# EAGLE design Cymru 55 (EAGLE 9.3.0)

## Sheet 1 of 2
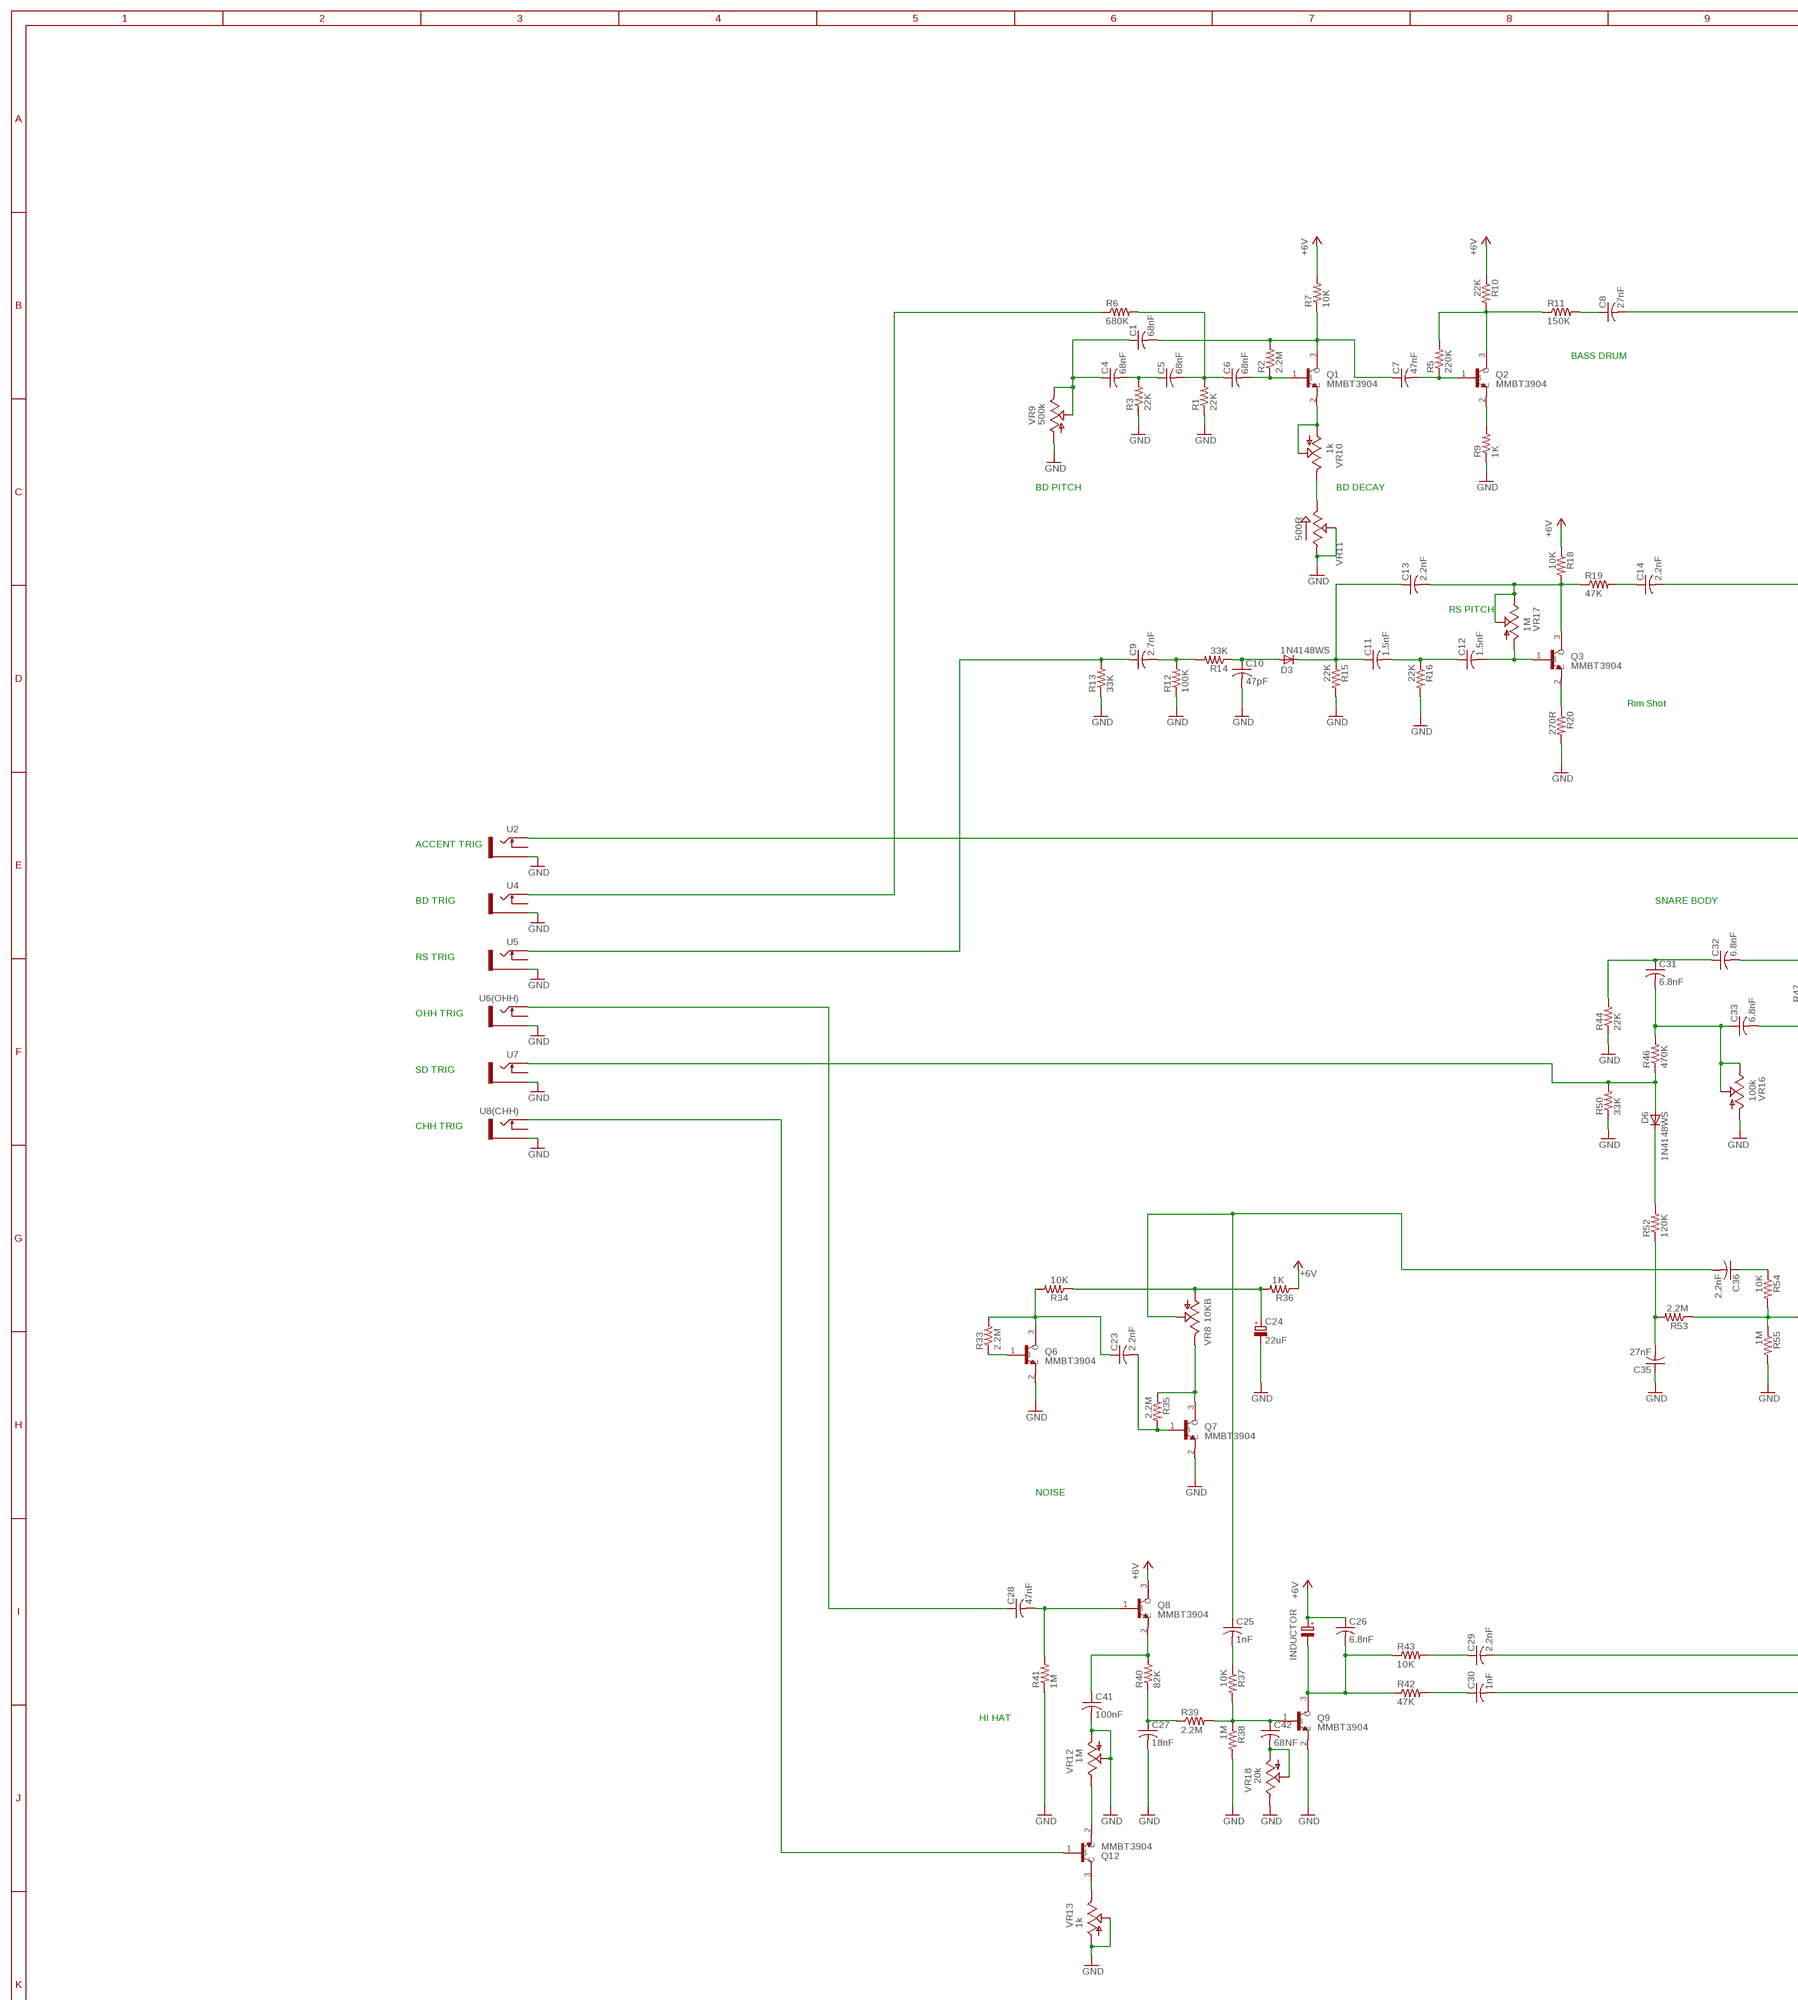
[diagram p0: schematic, sheet 1, part 1 of 3]
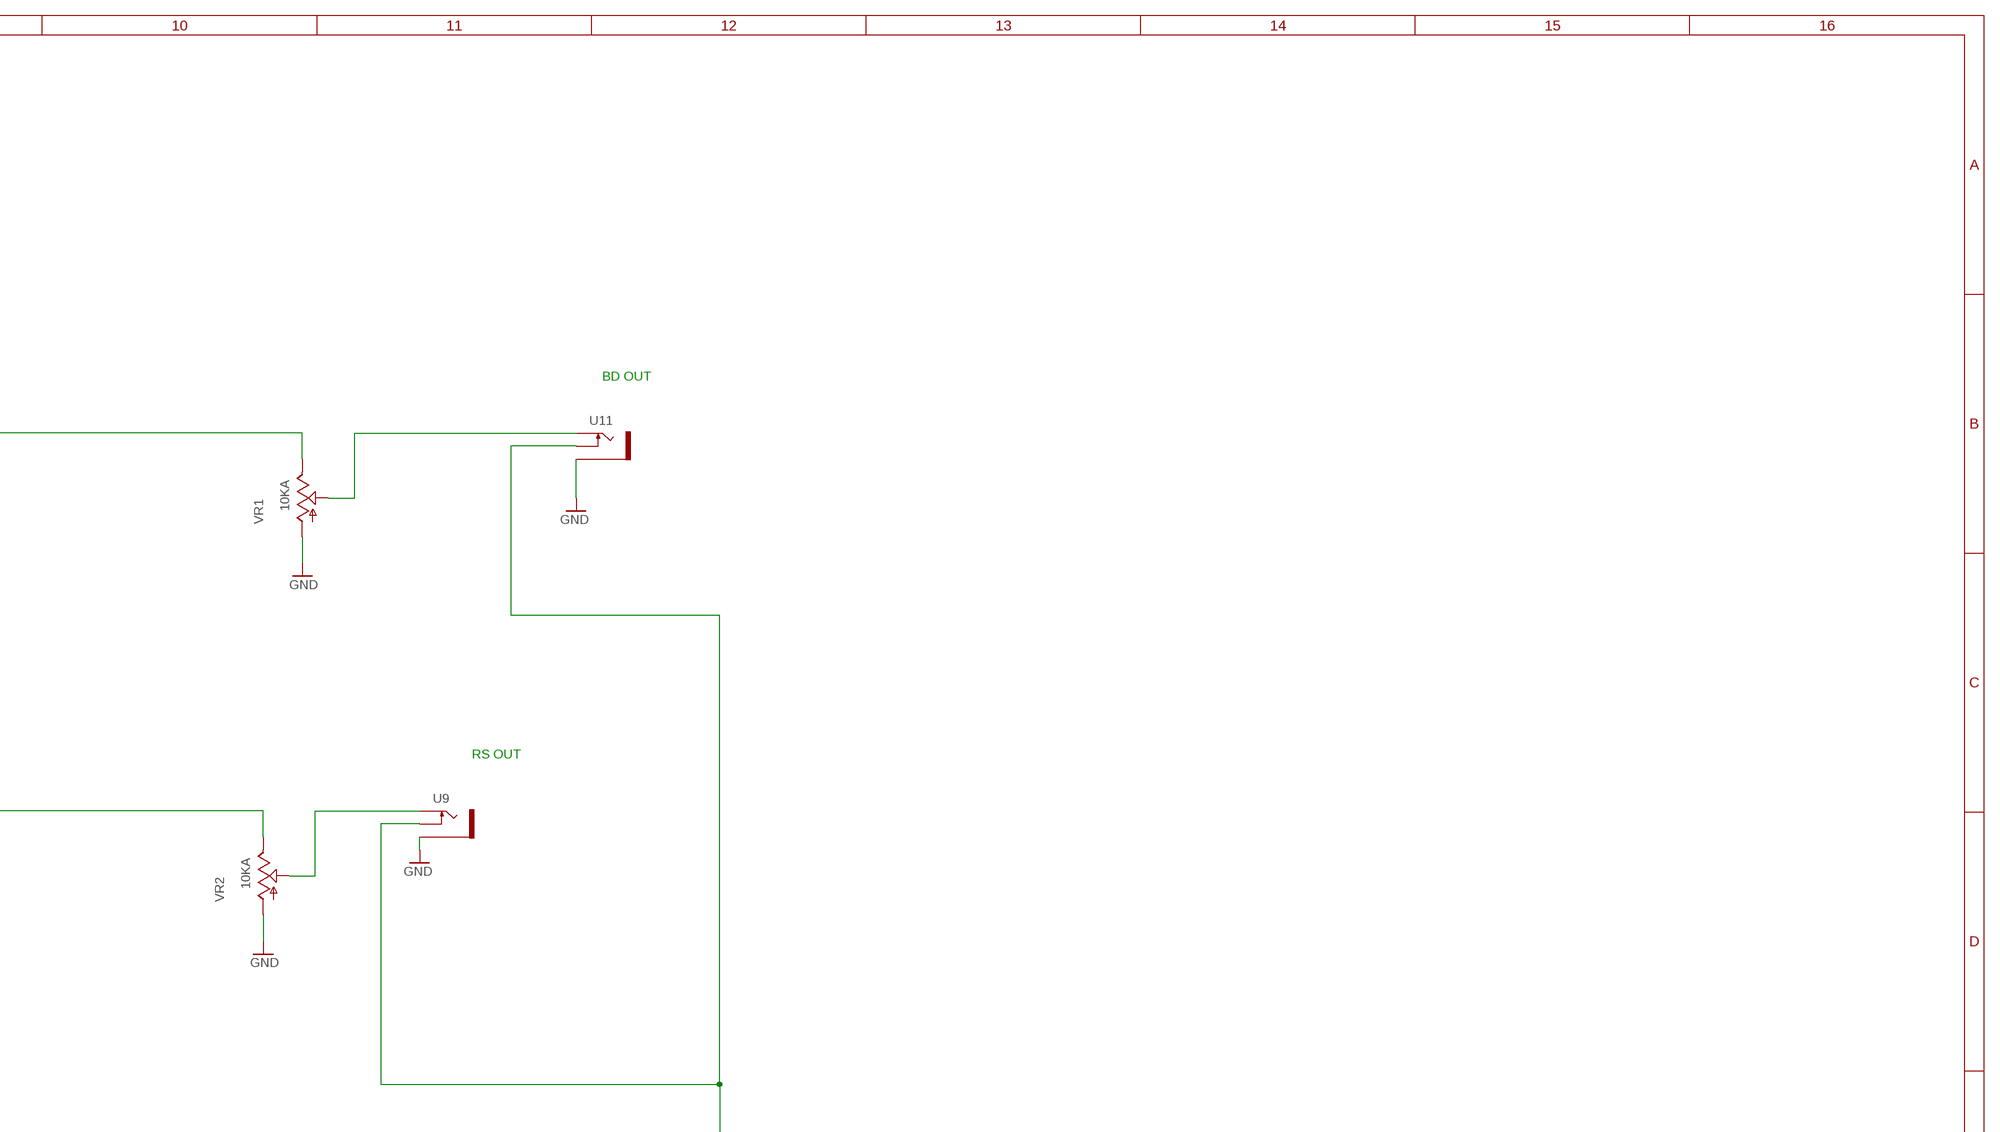
[diagram p1: schematic, sheet 1, part 2 of 3]
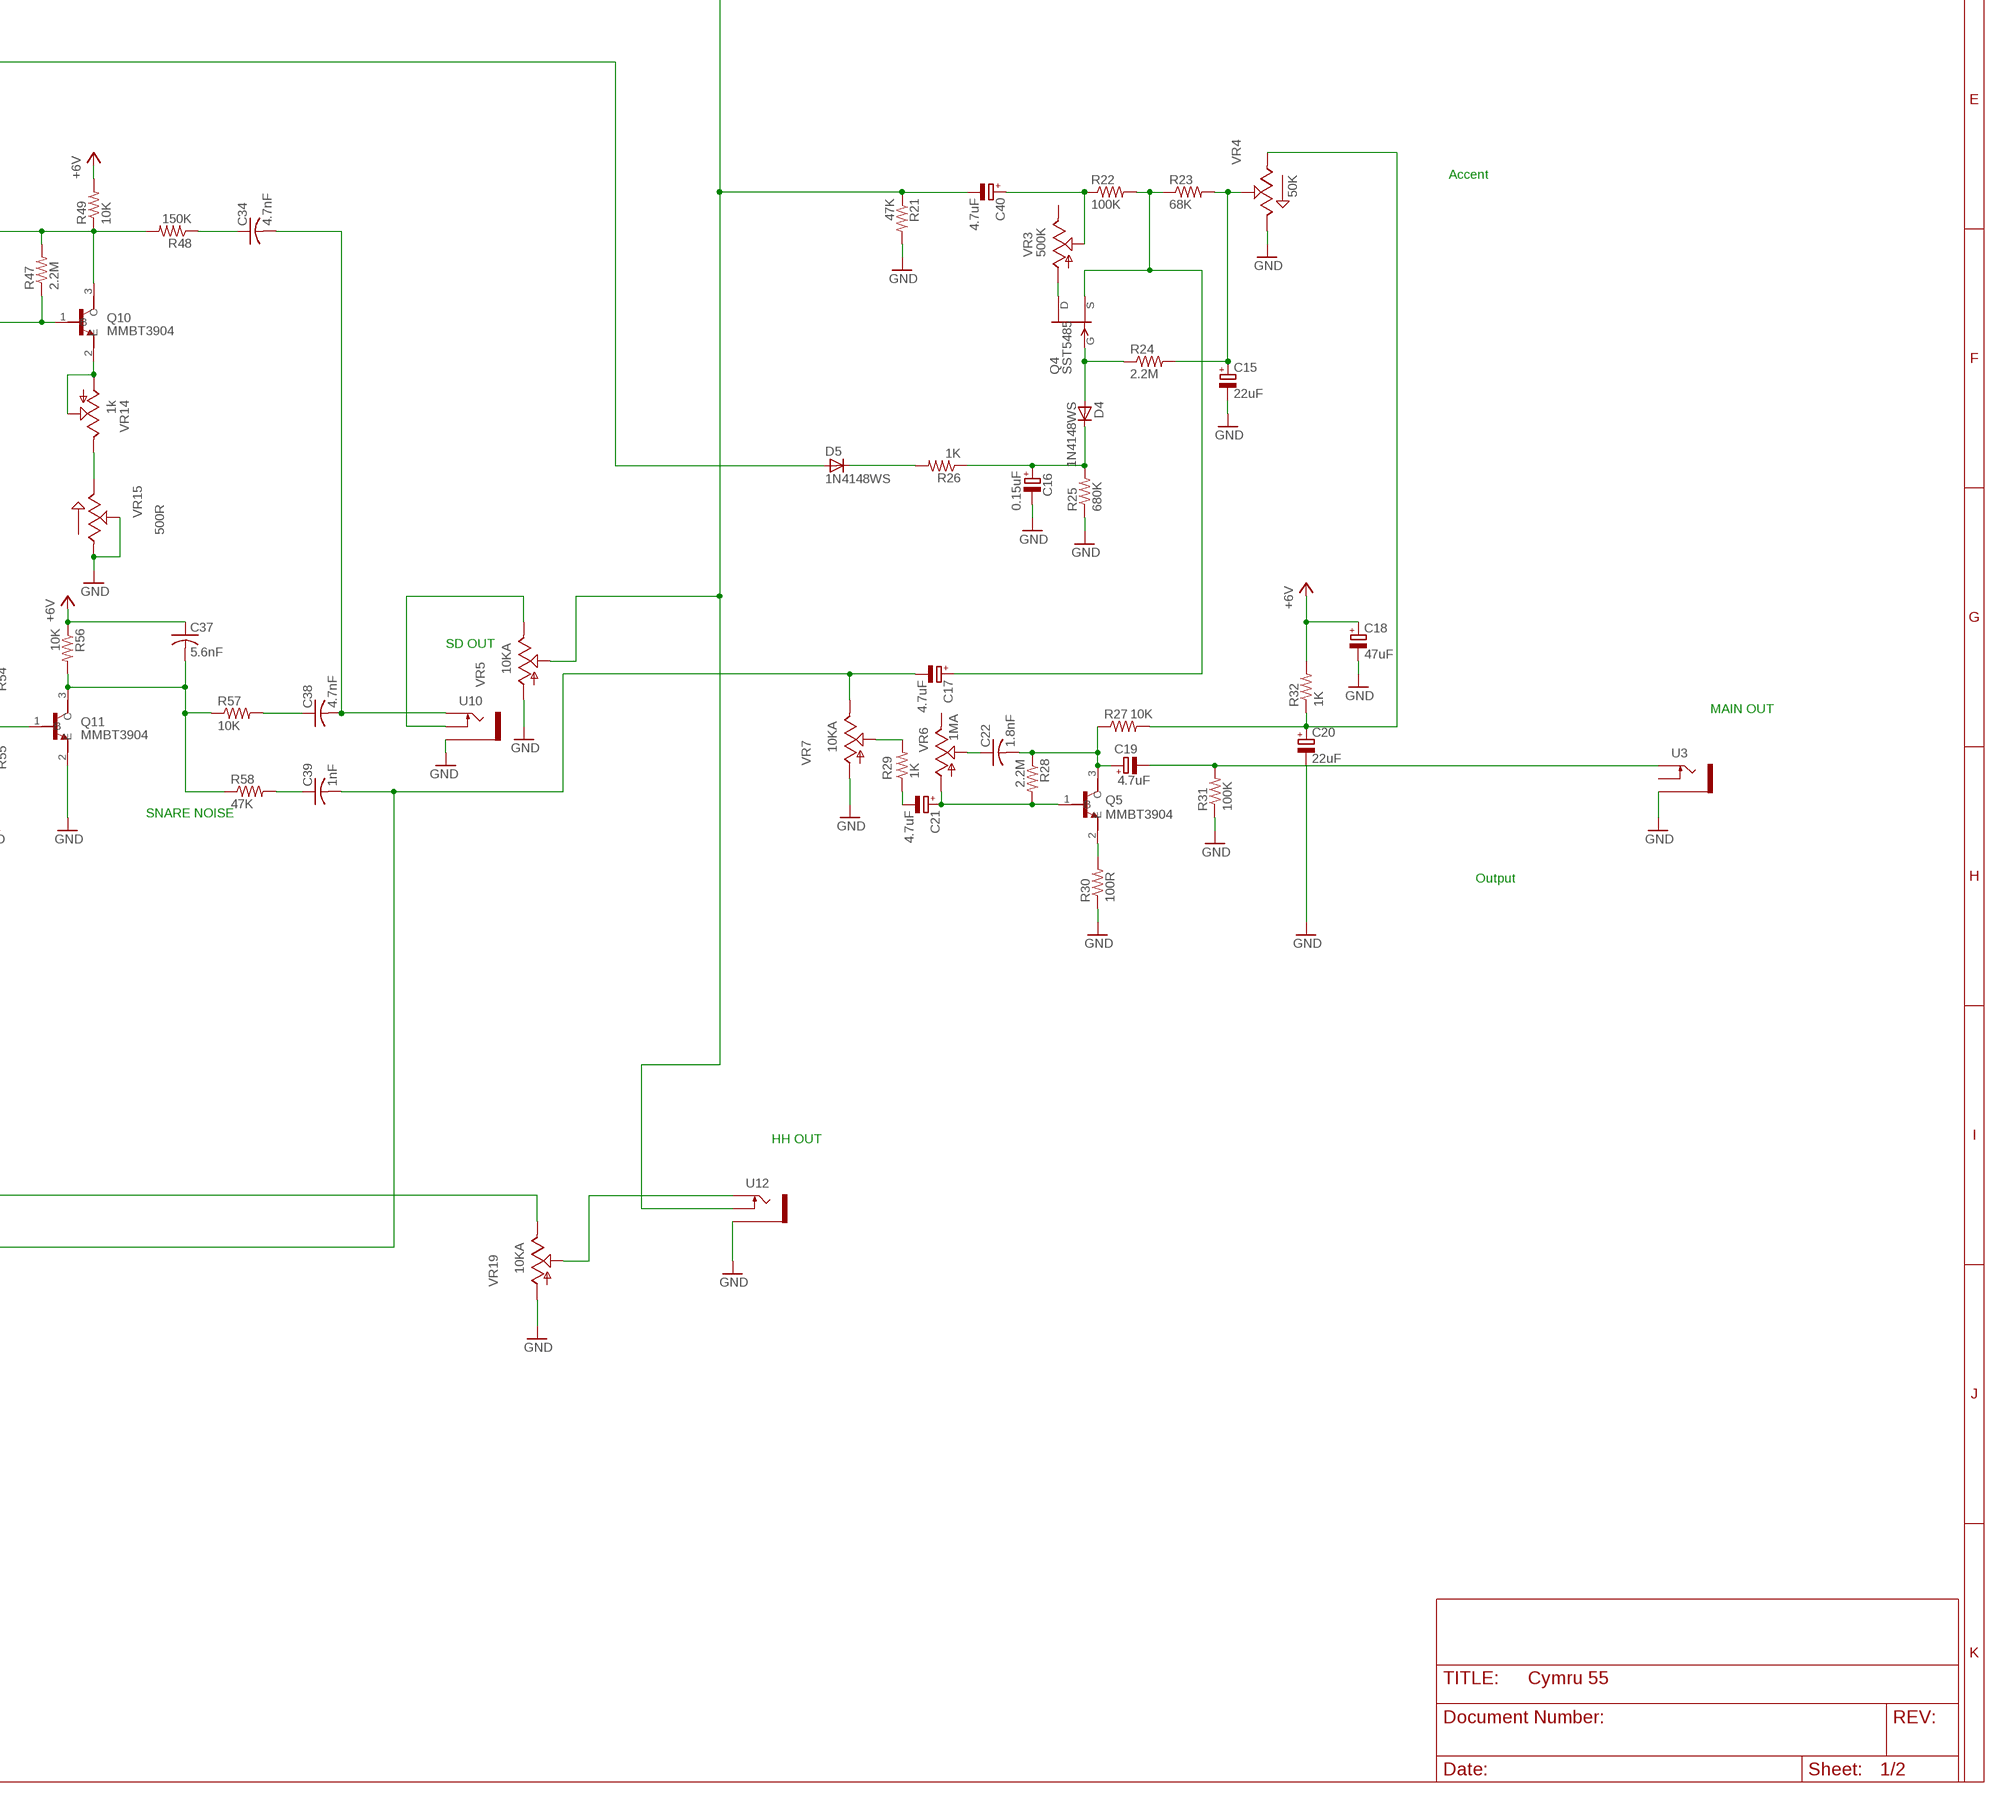
[diagram p2: schematic, sheet 1, part 3 of 3]

### Parts
C1  68nF  C-USC0603  [C0603]
C4  68nF  C-USC0603  [C0603]
C5  68nF  C-USC0603  [C0603]
C6  68nF  C-USC0603  [C0603]
C7  47nF  C-USC0603  [C0603]
C8  27nF  C-USC0603  [C0603]
C9  2.7nF  C-USC0603  [C0603]
C10  47pF  C-USC0603  [C0603]
C11  1.5nF  C-USC0603  [C0603]
C12  1.5nF  C-USC0603  [C0603]
C13  2.2nF  C-USC0603  [C0603]
C14  2.2nF  C-USC0603  [C0603]
C15  22uF  CPOL-EUE2.5-4V  [E2,5RE]
C16  0.15uF  CPOL-EUE2.5-4V  [E2,5RE]
C17  4.7uF  CPOL-EUE2.5-4V  [E2,5RE]
C18  47uF  CPOL-EUE2.5-4V  [E2,5RE]
C19  4.7uF  CPOL-EUE2.5-4V  [E2,5RE]
C20  22uF  CPOL-EUE2.5-4V  [E2,5RE]
C21  4.7uF  CPOL-EUE2.5-4V  [E2,5RE]
C22  1.8nF  C-USC0603  [C0603]
C23  2.2nF  C-USC0603  [C0603]
C24  22uF  CPOL-EUE2.5-4V  [E2,5RE]
C25  1nF  C-USC0603  [C0603]
C26  6.8nF  C-USC0603  [C0603]
C27  18nF  C-USC0603  [C0603]
C28  47nF  C-USC0603  [C0603]
C29  2.2nF  C-USC0603  [C0603]
C30  1nF  C-USC0603  [C0603]
C31  6.8nF  C-USC0603  [C0603]
C32  6.8nF  C-USC0603  [C0603]
C33  6.8nF  C-USC0603  [C0603]
C34  4.7nF  C-USC0603  [C0603]
C35  27nF  C-USC0603  [C0603]
C36  2.2nF  C-USC0603  [C0603]
C37  5.6nF  C-USC0603  [C0603]
C38  4.7nF  C-USC0603  [C0603]
C39  1nF  C-USC0603  [C0603]
C40  4.7uF  CPOL-EUE2.5-4V  [E2,5RE]
C41  100nF  C-USC0603  [C0603]
C42  68NF  C-USC0603  [C0603]
D3  1N4148WS  [SOD323]
D4  1N4148WS  [SOD323]
D5  1N4148WS  [SOD323]
D6  1N4148WS  [SOD323]
INDUCTOR  47MH  CPOL-EUE2.5-4V  [E2,5RE]
Q1  MMBT3904  [SOT95P240X120-3N]
Q2  MMBT3904  [SOT95P240X120-3N]
Q3  MMBT3904  [SOT95P240X120-3N]
Q4  SST5485  [SOT23]
Q5  MMBT3904  [SOT95P240X120-3N]
Q6  MMBT3904  [SOT95P240X120-3N]
Q7  MMBT3904  [SOT95P240X120-3N]
Q8  MMBT3904  [SOT95P240X120-3N]
Q9  MMBT3904  [SOT95P240X120-3N]
Q10  MMBT3904  [SOT95P240X120-3N]
Q11  MMBT3904  [SOT95P240X120-3N]
Q12  MMBT3904  [SOT95P240X120-3N]
R1  22K  R-US_R0603  [R0603]
R2  2.2M  R-US_R0603  [R0603]
R3  22K  R-US_R0603  [R0603]
R5  220K  R-US_R0603  [R0603]
R6  680K  R-US_R0603  [R0603]
R7  10K  R-US_R0603  [R0603]
R9  1K  R-US_R0603  [R0603]
R10  22K  R-US_R0603  [R0603]
R11  150K  R-US_R0603  [R0603]
R12  100K  R-US_R0603  [R0603]
R13  33K  R-US_R0603  [R0603]
R14  33K  R-US_R0603  [R0603]
R15  22K  R-US_R0603  [R0603]
R16  22K  R-US_R0603  [R0603]
R18  10K  R-US_R0603  [R0603]
R19  47K  R-US_R0603  [R0603]
R20  270R  R-US_R0603  [R0603]
R21  47K  R-US_R0603  [R0603]
R22  100K  R-US_R0603  [R0603]
R23  68K  R-US_R0603  [R0603]
R24  2.2M  R-US_R0603  [R0603]
R25  680K  R-US_R0603  [R0603]
R26  1K  R-US_R0603  [R0603]
R27  10K  R-US_R0603  [R0603]
R28  2.2M  R-US_R0603  [R0603]
R29  1K  R-US_R0603  [R0603]
R30  100R  R-US_R0603  [R0603]
R31  100K  R-US_R0603  [R0603]
R32  1K  R-US_R0603  [R0603]
R33  2.2M  R-US_R0603  [R0603]
R34  10K  R-US_R0603  [R0603]
R35  2.2M  R-US_R0603  [R0603]
R36  1K  R-US_R0603  [R0603]
R37  10K  R-US_R0603  [R0603]
R38  1M  R-US_R0603  [R0603]
R39  2.2M  R-US_R0603  [R0603]
R40  82K  R-US_R0603  [R0603]
R41  1M  R-US_R0603  [R0603]
R42  47K  R-US_R0603  [R0603]
R43  10K  R-US_R0603  [R0603]
R44  22K  R-US_R0603  [R0603]
R46  470K  R-US_R0603  [R0603]
R47  2.2M  R-US_R0603  [R0603]
R48  150K  R-US_R0603  [R0603]
R49  10K  R-US_R0603  [R0603]
R50  33K  R-US_R0603  [R0603]
R52  120K  R-US_R0603  [R0603]
R53  2.2M  R-US_R0603  [R0603]
R54  10K  R-US_R0603  [R0603]
R55  1M  R-US_R0603  [R0603]
R56  10K  R-US_R0603  [R0603]
R57  10K  R-US_R0603  [R0603]
R58  47K  R-US_R0603  [R0603]
U2  THONKICONNNEW  [WQP-PJ301M-12_JACK]
U3  THONKICONNNEW  [WQP-PJ301M-12_JACK]
U4  THONKICONNNEW  [WQP-PJ301M-12_JACK]
U5  THONKICONNNEW  [WQP-PJ301M-12_JACK]
U6(OHH)  THONKICONNNEW  [WQP-PJ301M-12_JACK]
U7  THONKICONNNEW  [WQP-PJ301M-12_JACK]
U8(CHH)  THONKICONNNEW  [WQP-PJ301M-12_JACK]
U9  THONKICONNNEW  [WQP-PJ301M-12_JACK]
U10  THONKICONNNEW  [WQP-PJ301M-12_JACK]
U11  THONKICONNNEW  [WQP-PJ301M-12_JACK]
U12  THONKICONNNEW  [WQP-PJ301M-12_JACK]
VR1  10KA  9MM_SNAP-IN_POT_  [9MM_SNAP-IN_POT]
VR2  10KA  9MM_SNAP-IN_POT_  [9MM_SNAP-IN_POT]
VR3  500K  9MM_SNAP-IN_POT_  [9MM_SNAP-IN_POT]
VR4  50K  3296W-1-250LF  [TRIM_3296W-1-250LF]
VR5  10KA  9MM_SNAP-IN_POT_  [9MM_SNAP-IN_POT]
VR6  1MA  9MM_SNAP-IN_POT_  [9MM_SNAP-IN_POT]
VR7  10KA  9MM_SNAP-IN_POT_  [9MM_SNAP-IN_POT]
VR8  10KB  9MM_SNAP-IN_POT_  [9MM_SNAP-IN_POT]
VR9  500k  9MM_SNAP-IN_POT_  [9MM_SNAP-IN_POT]
VR10  1k  9MM_SNAP-IN_POT_  [9MM_SNAP-IN_POT]
VR11  500R  3296W-1-250LF  [TRIM_3296W-1-250LF]
VR12  1M  9MM_SNAP-IN_POT_  [9MM_SNAP-IN_POT]
VR13  1k  9MM_SNAP-IN_POT_  [9MM_SNAP-IN_POT]
VR14  1k  9MM_SNAP-IN_POT_  [9MM_SNAP-IN_POT]
VR15  500R  3296W-1-250LF  [TRIM_3296W-1-250LF]
VR16  100k  9MM_SNAP-IN_POT_  [9MM_SNAP-IN_POT]
VR17  1M  9MM_SNAP-IN_POT_  [9MM_SNAP-IN_POT]
VR18  20k  9MM_SNAP-IN_POT_  [9MM_SNAP-IN_POT]
VR19  10KA  9MM_SNAP-IN_POT_  [9MM_SNAP-IN_POT]

### Nets
+5V: C18.+ C26.1 C37.1 INDUCTOR.+ Q8.3(C) R7.2 R10.1 R18.1 R32.2 R36.1 R49.2 R56.1 ; supply symbol labelled +6V ; also sheet 2
GND: C10.2 C15.- C16.- C18.- C20.- C24.- C27.2 C35.1 C41.2 Q6.2(E) Q7.2(E) Q9.2(E) Q11.2(E) R1.1 R3.1 R9.1 R12.1 R13.1 R15.2 R16.2 R20.2 R21.2 R25.1 R30.1 R31.1 R38.2 R41.1 R44.1 R50.1 R55.2 U2.P$3_SLEEVE(SLEEVE) U3.P$3_SLEEVE(SLEEVE) U4.P$3_SLEEVE(SLEEVE) U5.P$3_SLEEVE(SLEEVE) U6(OHH).P$3_SLEEVE(SLEEVE) U7.P$3_SLEEVE(SLEEVE) U8(CHH).P$3_SLEEVE(SLEEVE) U9.P$3_SLEEVE(SLEEVE) U10.P$3_SLEEVE(SLEEVE) U11.P$3_SLEEVE(SLEEVE) U12.P$3_SLEEVE(SLEEVE) VR1.1(A) VR2.1(A) VR4.3(CW) VR5.1(A) VR7.1(A) VR9.1(A) VR11.1(CCW) VR11.2(WIPER) VR12.1(A) VR12.2(S) VR13.1(A) VR13.2(S) VR15.1(CCW) VR15.2(WIPER) VR16.1(A) VR18.3(E) VR19.1(A) ; also sheet 2
N$1: U10.P$2_SWITCH(SWITCH) VR5.3(E)
N$2: C1.1 C4.1 VR9.2(S) VR9.3(E)
N$3: C1.2 C7.1 Q1.3(C) R2.2 R7.1
N$5: C6.2 Q1.1(B) R2.1
N$6: C5.2 C6.1 R1.2 R6.2
N$7: C4.2 C5.1 R3.2
N$8: Q3.2(E) R20.1
N$9: C9.2 R12.2 R14.2
N$10: Q1.2(E) VR10.1(A) VR10.2(S)
N$11: C10.1 D3.A R14.1
N$12: C7.2 Q2.1(B) R5.1
N$13: Q2.3(C) R5.2 R10.2 R11.1
N$14: Q2.2(E) R9.2
N$15: C8.1 R11.2
N$16: C11.1 C13.1 D3.C R15.1
N$17: C11.2 C12.1 R16.1
N$18: C9.1 R13.2 U5.P$1_TIP(TIP)
N$19: D4.A Q4.3(G) R24.1
N$20: C16.+ D4.C R25.2 R26.1
N$21: C12.2 Q3.1(B) VR17.1(A)
N$22: C14.2 VR2.3(E)
N$23: C14.1 R19.2
N$24: Q4.1(D) VR3.1(A)
N$25: C40.+ R22.1 VR3.2(S)
N$26: C21.- R29.1
N$27: C17.- C30.2 C39.2 VR7.3(E)
N$28: C15.+ R23.2 R24.2 VR4.2(WIPER)
N$29: C17.+ Q4.2(S) R22.2 R23.1
N$30: R29.2 VR7.2(S)
N$31: C21.+ Q5.1(B) R28.2 VR6.1(A)
N$32: C22.1 VR6.2(S)
N$33: C19.- R31.2 U3.P$1_TIP(TIP)
N$34: Q6.1(B) R33.1
N$35: C20.+ R27.2 R32.1 VR4.1(CCW)
N$36: Q5.2(E) R30.2
N$37: C23.1 Q6.3(C) R33.2 R34.2
N$38: C25.1 C36.2 VR8.2(S)
N$39: C23.2 Q7.1(B) R35.2
N$40: Q7.3(C) R35.1 VR8.3(E)
N$41: C24.+ R34.1 R36.2 VR8.1(A)
N$42: C25.2 R37.1
N$43: C42.2 VR18.1(A) VR18.2(S)
N$44: C27.1 R39.1 R40.1
N$45: C41.1 Q8.2(E) R40.2
N$46: C26.2 INDUCTOR.- Q9.3(C) R42.1 R43.1
N$47: C28.2 Q8.1(B) R41.2
N$48: C29.1 R43.2
N$49: C30.1 R42.2
N$50: D5.C R26.2
N$51: C31.1 C32.1 R44.2
N$52: C13.2 Q3.3(C) R18.2 R19.1 VR17.2(S) VR17.3(E)
N$53: C32.2 Q10.3(C) R47.2 R48.2 R49.1
N$54: C34.1 R48.1
N$55: C33.2 Q10.1(B) R47.1
N$56: C31.2 C33.1 R46.2 VR16.2(S) VR16.3(E)
N$57: C8.2 VR1.3(E)
N$58: D6.C R52.2
N$59: C35.2 R52.1 R53.2
N$60: Q11.1(B) R53.1 R54.2 R55.1
N$61: C36.1 R54.1
N$62: C37.2 Q11.3(C) R56.2 R57.1 R58.1
N$63: R6.1 U4.P$1_TIP(TIP)
N$64: C39.1 R58.2
N$65: C38.1 R57.2
N$66: D5.A U2.P$1_TIP(TIP)
N$67: C28.1 U6(OHH).P$1_TIP(TIP)
N$68: D6.A R46.1 R50.2 U7.P$1_TIP(TIP)
N$69: VR10.3(E) VR11.3(CW)
N$70: Q12.2(E) VR12.3(E)
N$71: Q10.2(E) VR14.1(A) VR14.2(S)
N$72: Q12.3(C) VR13.3(E)
N$73: Q12.1(B) U8(CHH).P$1_TIP(TIP)
N$74: VR14.3(E) VR15.3(CW)
N$75: C34.2 C38.2 U10.P$1_TIP(TIP)
N$76: U9.P$1_TIP(TIP) VR2.2(S)
N$78: C19.+ C22.2 Q5.3(C) R27.1 R28.1
N$79: C42.1 Q9.1(B) R37.2 R38.1 R39.2
N$80: U11.P$1_TIP(TIP) VR1.2(S)
N$82: C40.- R21.1 U9.P$2_SWITCH(SWITCH) U11.P$2_SWITCH(SWITCH) U12.P$2_SWITCH(SWITCH) VR5.2(S)
N$83: C29.2 VR19.3(E)
N$84: U12.P$1_TIP(TIP) VR19.2(S)
Unconnected: U2.P$2_SWITCH(SWITCH) U3.P$2_SWITCH(SWITCH) U4.P$2_SWITCH(SWITCH) U5.P$2_SWITCH(SWITCH) U6(OHH).P$2_SWITCH(SWITCH) U7.P$2_SWITCH(SWITCH) U8(CHH).P$2_SWITCH(SWITCH) VR3.3(E) VR6.3(E)

### Notes on the sheet
- BD OUT
- BASS DRUM
- BD PITCH | BD DECAY
- RS OUT
- RS PITCH
- Rim Shot
- ACCENT TRIG
- BD TRIG | SNARE BODY
- Accent
- RS TRIG
- OHH TRIG
- SD TRIG
- CHH TRIG
- SD OUT
- MAIN OUT
- SNARE NOISE
- Output
- NOISE
- HH OUT
- HI HAT

## Sheet 2 of 2
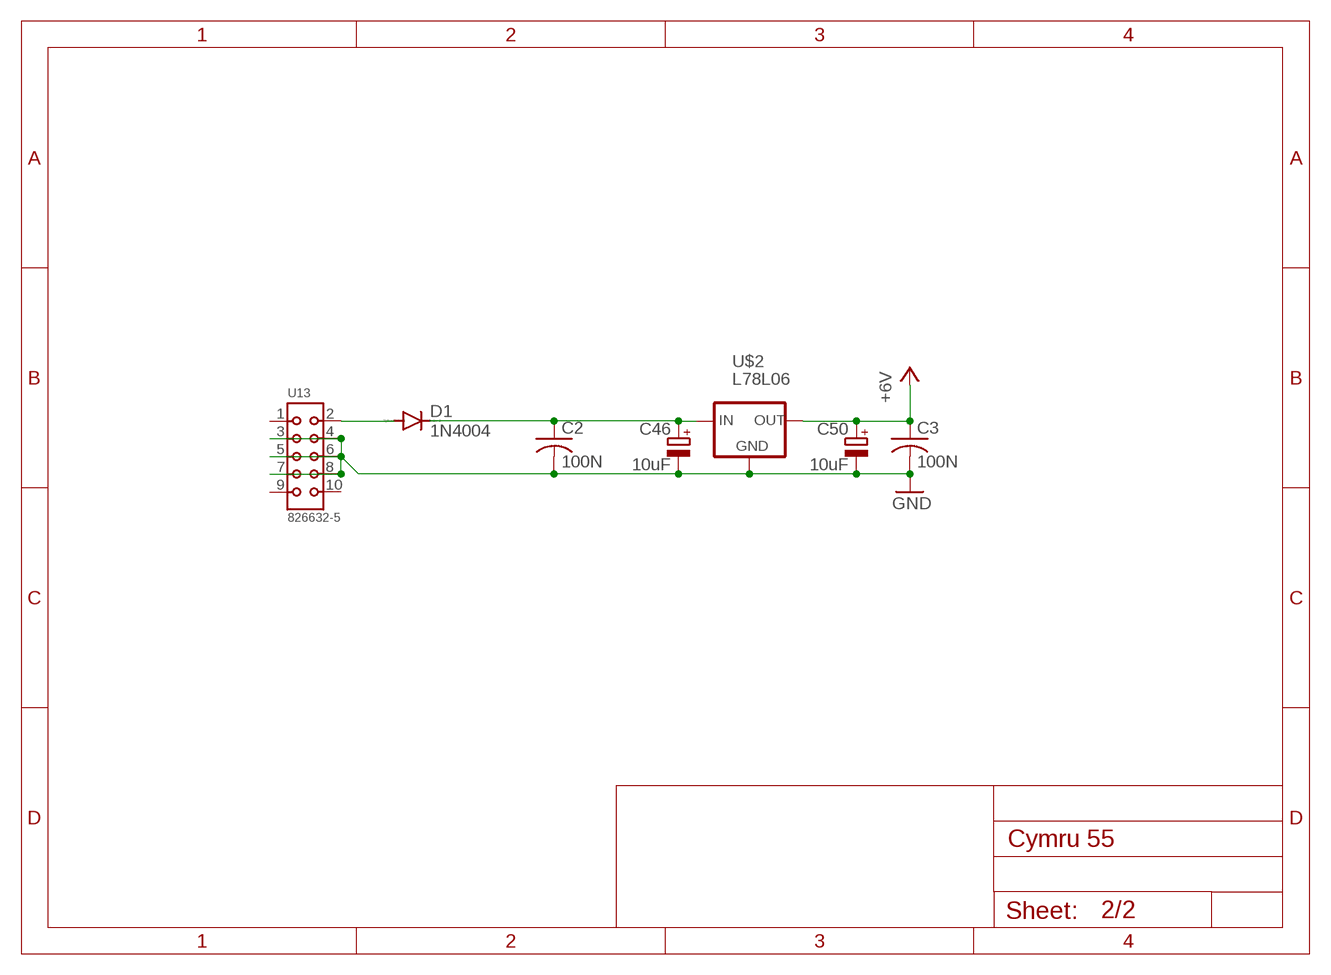
[diagram p3: schematic, sheet 2]

### Parts
C2  100N  C-USC0603  [C0603]
C3  100N  C-USC0603  [C0603]
C46  10uF  CPOL-EUE2.5-4V  [E2,5RE]
C50  10uF  CPOL-EUE2.5-4V  [E2,5RE]
D1  1N4004  [DO41-10]
U13  826632-5  [HDRV10W63P254_2X5_1270X500X950P]
U$2  L78L06  [SOT89]

### Nets
+5V: C3.1 C50.+ U$2.1(OUT) ; supply symbol labelled +6V ; also sheet 1
GND: C2.2 C3.2 C46.- C50.- U13.3 U13.4 U13.5 U13.6 U13.7 U13.8 U$2.2(GND) ; also sheet 1
N$77: C2.1 C46.+ D1.C U$2.3(IN)
N$81: D1.A U13.2
Unconnected: U13.1 U13.9 U13.10

## Library data of the parts
C1-C14 C22 C23 C25-C39 C41 C42 = resistor:C-US: CAPACITOR, American symbol
C15-C21 C24 C40 C46 C50 INDUCTOR = resistor:CPOL-EU: POLARIZED CAPACITOR, European symbol
D1 = diode:1N4004: DIODE general purpose rectifier, 1 A
D3-D6 = 1N4148WS:1N4148WS: http://octopart.com/1n4148ws-fairchild+semiconductor-7851016; AVAILABILITY: Unavailable; DESCRIPTION: Diode Switching 75V 0.3A 2-Pin SOD-323 T/R; MF: ON Semiconductor; MP: 1N4148WS; PACKAGE: S-0 Good-Ark; PRICE: None
Q1-Q3 Q5-Q12 = MMBT3904:MMBT3904: MMBT3904 Series 40 V CE Breakdown 0.2 A NPN General Purpose Amplifier - SOT-23; AVAILABILITY: Unavailable; DESCRIPTION: SOT-23, 60V, 0.2A, NPN Bipolar Transistor; MF: STMicroelectronics; MP: MMBT3904; PACKAGE: SOT-23-3 Taiwan Semiconductor; PRICE: None
Q4 = transistor-fet:?548*: N-Channel JFETs Source: VISHAY 2N5484.pdf Compatible: TO92 2N5245 J304 J305 U310 J308 J309 J310 TO72 2N4416 2N4416A 2N3823 2N4351 3N169 3N170 3N171 MFE3002 TO18 2N3796 2N3797 MFE825 Source: Motorola European Master Guide Pacge 3-59
R1-R3 R5-R7 R9-R16 R18-R44 R46-R50 R52-R58 = resistor:R-US_: RESISTOR, American symbol
U2-U5 U6(OHH) U7 U8(CHH) U9-U12 = MusicThingModular:THONKICONN: 3.5mm socket for Eurorack modular synths
U13 = 826632-5:826632-5: Conn Unshrouded Header HDR 10 POS 2.54mm Solder ST Thru-Hole Automotive Box; AVAILABILITY: Unavailable; DESCRIPTION: AMPMODU 10 Position Through-Hole Dual Row Straight 2.54 mm Breakaway Header; MF: TE; MP: 826632-5; PACKAGE: None; PRICE: None
U$2 = L78L05ACU:L78L06: 6V Positive voltage regulator SMD SOT89 Package; AVAILABILITY: Unavailable; DESCRIPTION: Voltage regulator; fixed; 5V; 0.1A; SOT89; SMD; Package: reel, tape; MF: STMicroelectronics; MP: L78L05ACU-TR; PACKAGE: None; PRICE: None
VR1-VR3 VR5-VR10 VR12-VR14 VR16-VR19 = MusicThingModular:9MM_SNAP-IN_POT: 9mm vertical snap-in pot, Alpha / Panasonic style
VR4 VR11 VR15 = 3296W-1-250LF (1):3296W-1-250LF: Res Cermet Trimmer 25 Ohm 10% 1/2W 25(Elec)Turn 2.19mm (9.53 X 4.83 X 11.55mm) Pin Thru-Hole Tube; AVAILABILITY: Unavailable; DESCRIPTION: Res Cermet Trimmer 25 Ohm 10% 1/2W 25_Elec_Turn 2.19mm _9.53 X 4.83 X 11.55mm_ Pin Thru-Hole Tube; MF: Bourns; MP: 3296W-1-250LF; PACKAGE: SOT-23-5 Bourns; PRICE: None

## Board
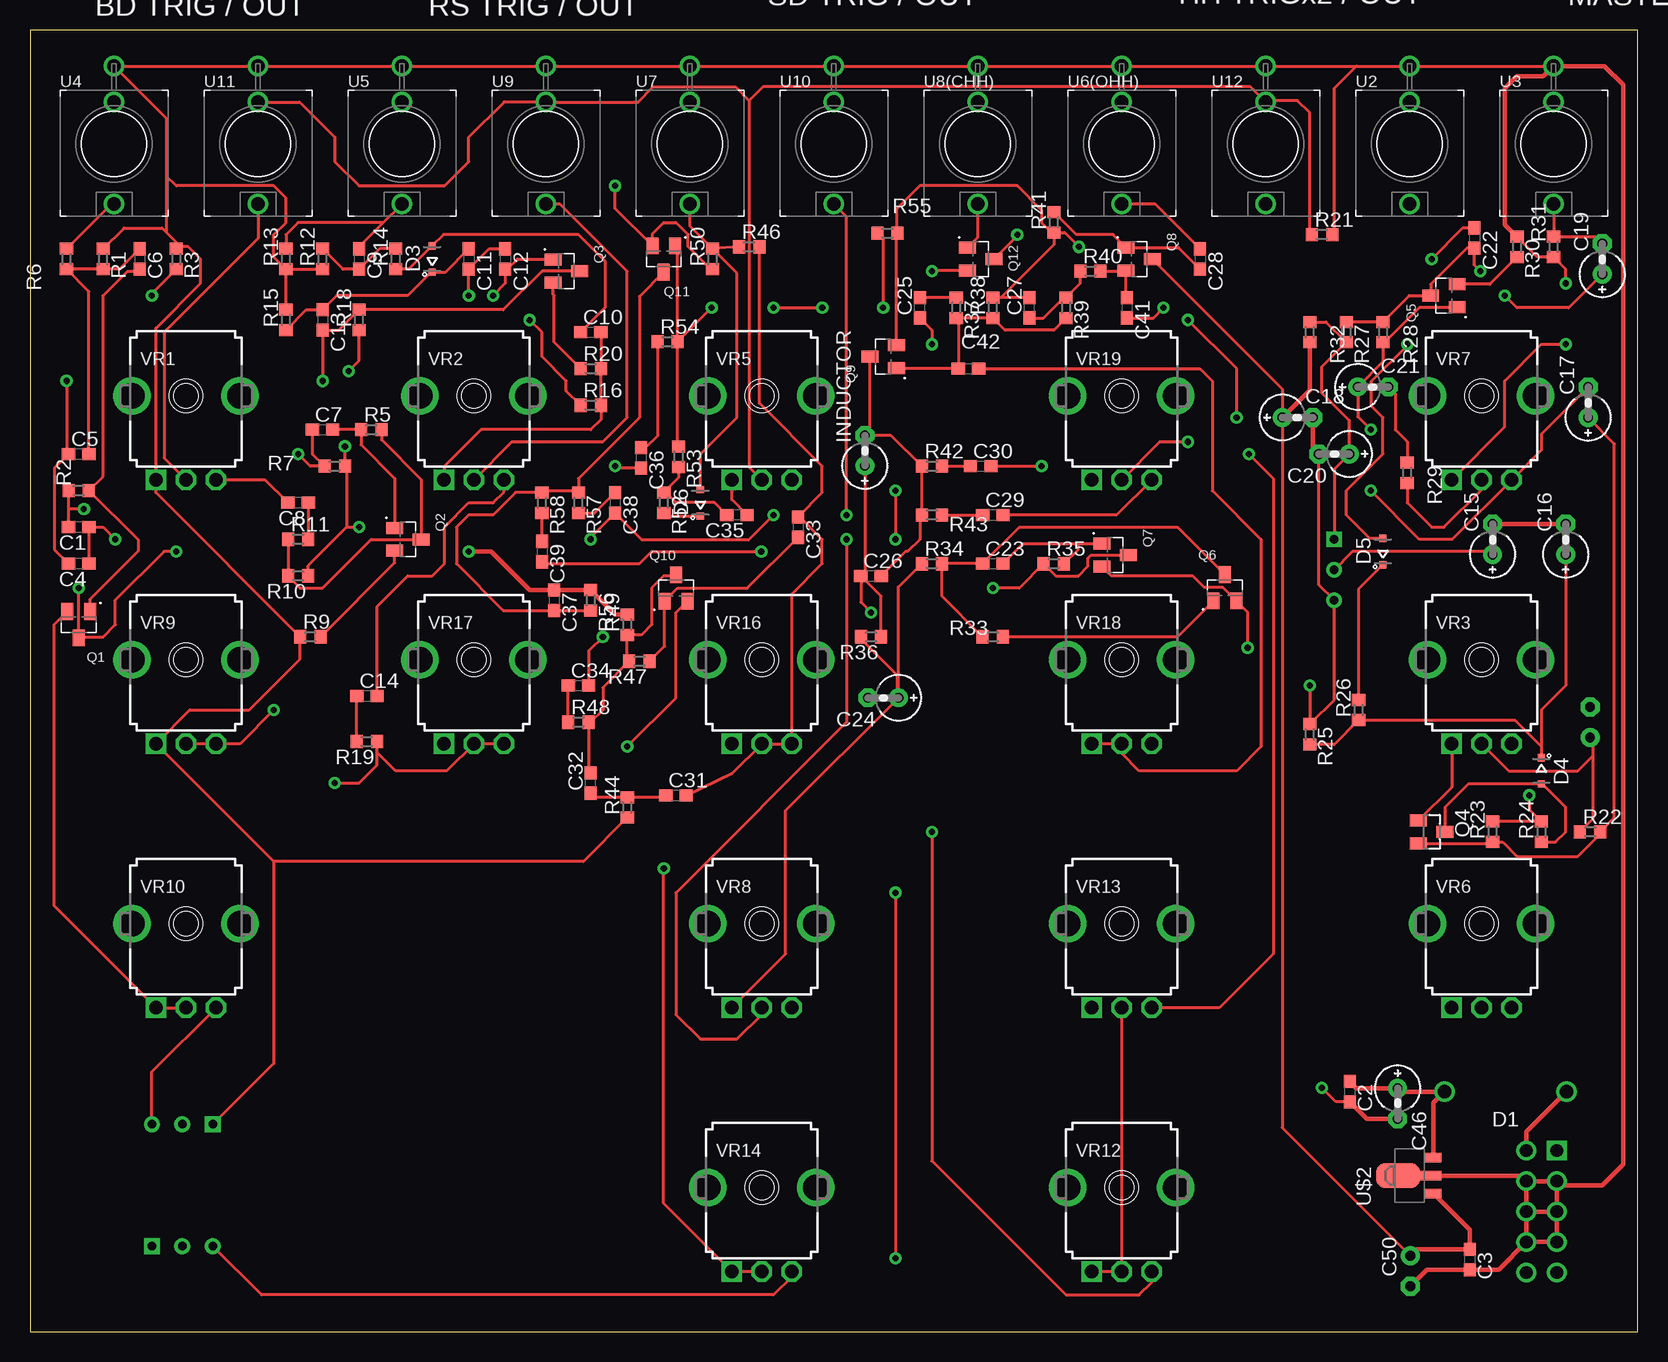
[diagram p4: board, top side]
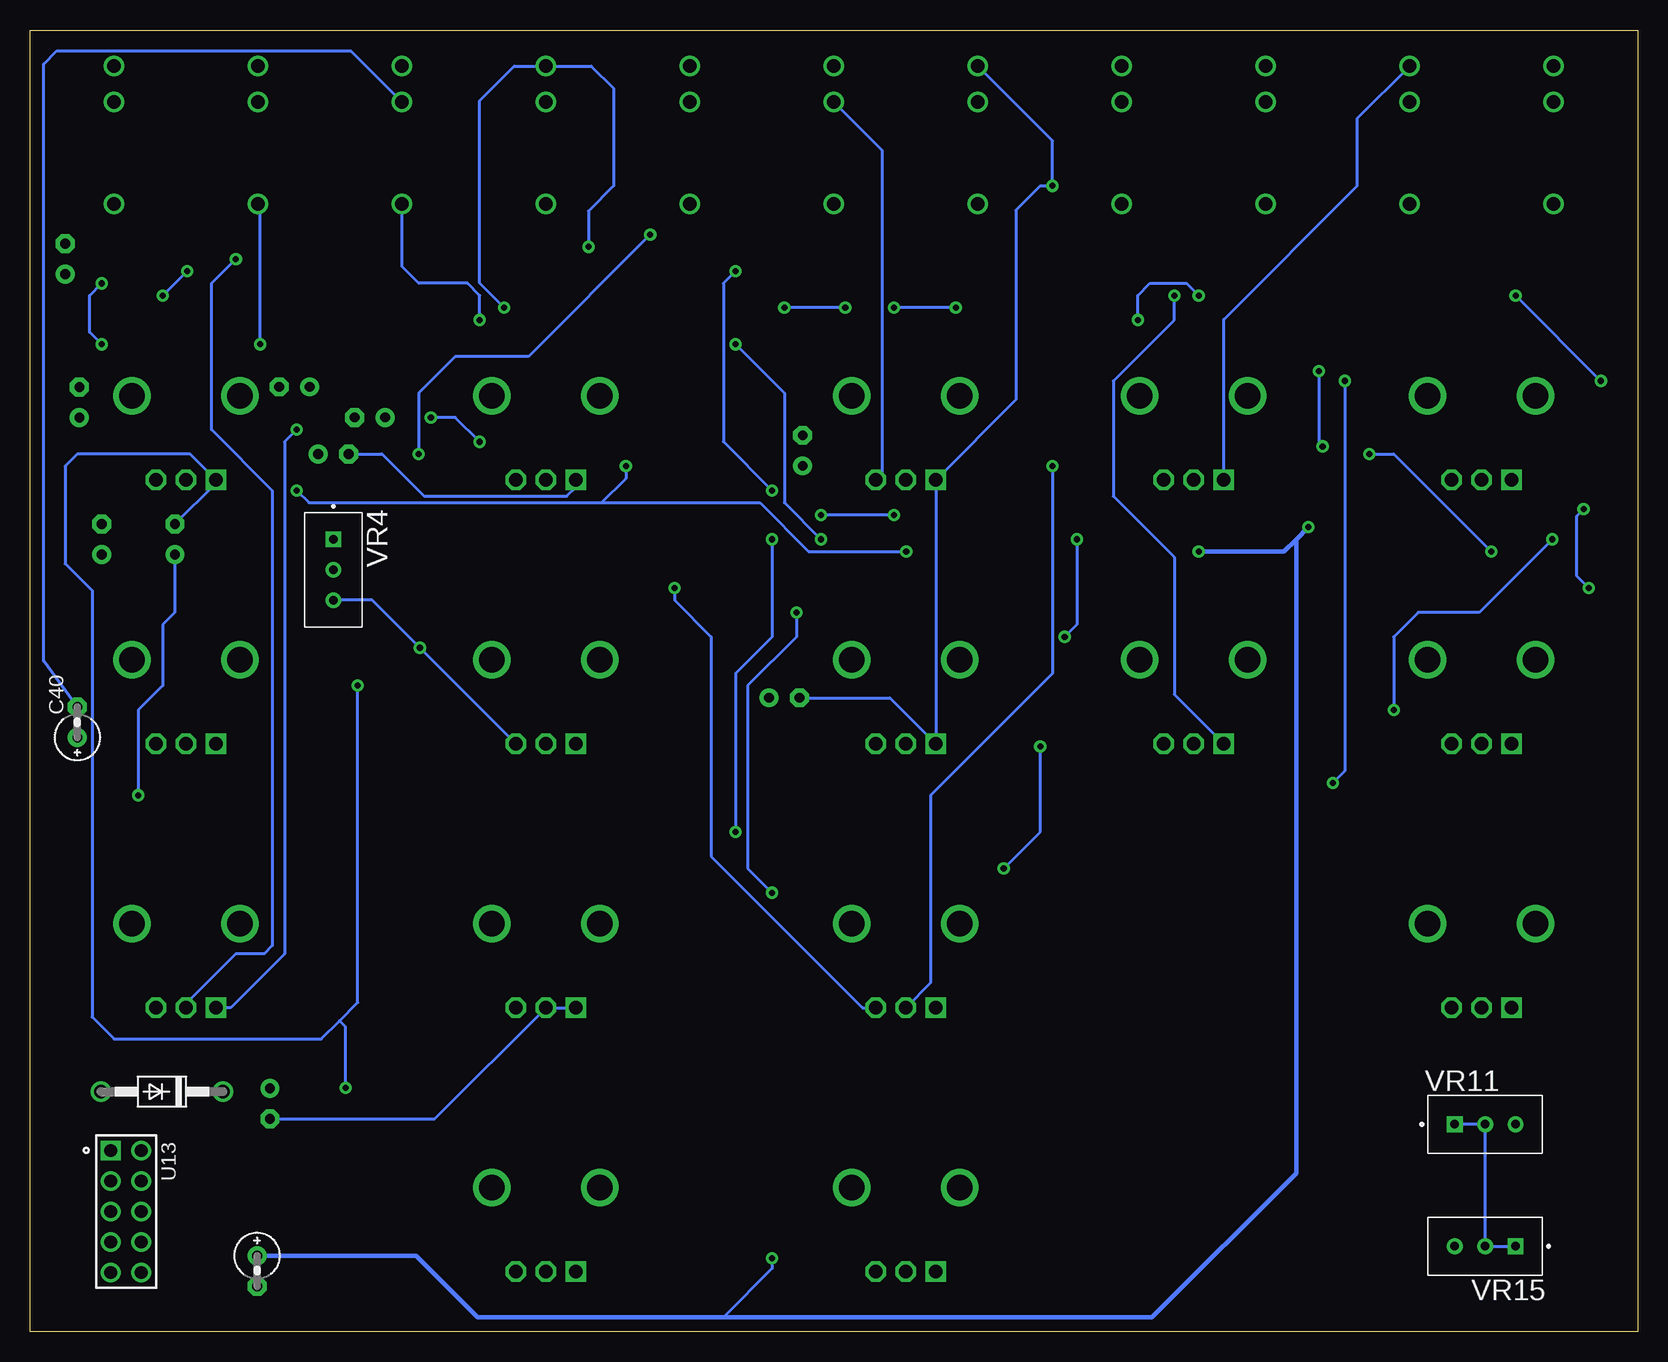
[diagram p5: board, bottom side, seen from below]

Size 134 x 108.5 mm. Coordinates in mm from the lower left corner, seen from the top.
Outline: 0,0 134,0 134,108.5 0,108.5 0,0
Copper layers (1*16): Top 0.035mm / dielectric 1.5mm / Bottom 0.035mm
Design rules "SparkFun": minimum track width 8mil, minimum drill 20mil, track to track 8mil, track to pad 8mil, pad to pad 8mil, via to via 8mil, smd to smd 8mil, copper to edge 8mil, drill to drill 8mil, minimum pad ring 12mil, minimum via ring 10mil, stop-mask expansion 4mil, vias tented up to drill 20mil, thermal gap 10mil

### Footprints (pad centres in the part's own frame; a part is rotated, then mirrored left to right if it is on the bottom)
C0603 = smd 1.1 x 1: 1 -0.85,0; 2 0.85,0
E2,5RE = drill 0.813 pad 1.575: + -1.27,0 | drill 0.813 pad 1.575 octagon: - 1.27,0
DO41-10 = drill 1.118: A 5.08,0; C -5.08,0
SOD323 = smd 0.6 x 0.6: A 1.1,0; C -1.1,0
SOT95P240X120-3N = smd 1 x 1.4: 1 -0.95,-1.1; 2 0.95,-1.1; 3 0,1.1
SOT23 = smd 1 x 1.4: 1 -0.95,-1.1; 2 0.95,-1.1; 3 0,1.1
R0603 = smd 1 x 1.1: 1 -0.85,0; 2 0.85,0
WQP-PJ301M-12_JACK = drill 1.1: P$1_TIP 0,5; P$2_SWITCH 0,-3.5; P$3_SLEEVE 0,-6.5
HDRV10W63P254_2X5_1270X500X950P = drill 1.05 pad 1.6 square: 1 -5.08,-1.27 | drill 1.05 pad 1.6: 2 -5.08,1.27; 3 -2.54,-1.27; 4 -2.54,1.27; 5 0,-1.27; 6 0,1.27; 7 2.54,-1.27; 8 2.54,1.27; 9 5.08,-1.27; 10 5.08,1.27
SOT89 = smd 0.8 x 1.4: 1 -1.499,-1.981; 3 1.499,-1.981 | smd 0.8 x 1.9: 2 0,-1.727 | smd 2.032 x 3.65: 2@1 0,0.94
9MM_SNAP-IN_POT = drill 1.1 square: 1 -2.5,-7 | drill 1.1 octagon: 2 0,-7; 3 2.5,-7 | drill 2.1 pad 2.794: CHASSIS1 -4.5,0; CHASSIS2 4.5,0
TRIM_3296W-1-250LF = drill 0.71 square: 1 0,0 | drill 0.71: 2 2.54,0; 3 5.08,0

### Placement (x,y rotation side)
C1  4.06,67.06 180 top
C2  110,20 270 top
C3  120,6 270 top
C4  4.06,64.01 180 top
C5  4.06,73.15 0 top
C6  9.14,89.41 270 top
C7  24.38,75.18 0 top
C8  22.35,69.09 180 top
C9  27.43,89.41 270 top
C10  46.74,83.31 0 top
C11  36.58,89.41 270 top
C12  39.62,89.41 270 top
C13  24.38,84.33 270 top
C14  28.09,52.99 0 top
C15  121.92,66.04 90 top
C16  128.02,66.04 90 top
C17  129.88,77.45 90 top
C18  105.66,76.2 0 top
C19  131.06,89.41 90 top
C20  108.71,73.15 180 top
C21  111.95,78.75 0 top
C22  120.41,91.16 270 top
C23  80.26,64.01 0 top
C24  71.12,52.83 180 top
C25  74.17,85.34 90 top
C26  70.1,62.99 0 top
C27  83.31,85.34 90 top
C28  97.54,89.41 270 top
C29  80.26,68.07 0 top
C30  79.25,72.14 0 top
C31  53.85,44.7 0 top
C32  46.74,45.72 90 top
C33  64.01,67.06 270 top
C34  45.72,53.85 0 top
C35  58.93,68.07 180 top
C36  50.93,72.83 270 top
C37  43.69,60.96 270 top
C38  48.77,69.09 270 top
C39  42.67,65.02 270 top
C40  130.05,50.8 90 bottom
C41  91.44,85.34 270 top
C42  78.23,80.26 0 top
C46  114,19 270 top
C50  115.07,5.05 270 bottom
D1  123,20 180 bottom
D3  33.53,89.41 90 top
D4  125.98,46.74 270 top
D5  112.78,65.02 90 top
D6  55.88,69.09 90 top
INDUCTOR  69.59,73.44 90 top
Q1  4.06,58.93 180 top
Q2  31.5,66.04 270 top
Q3  44.7,88.39 270 top
Q4  116.84,41.66 270 top
Q5  117.86,86.36 90 top
Q6  99.6,62.02 0 top
Q7  90.46,64.73 270 top
Q8  92.46,89.41 270 top
Q9  71.12,81.28 90 top
Q10  53.85,61.98 0 top
Q11  52.83,89.41 180 top
Q12  79.25,89.41 270 top
R1  6.1,89.41 270 top
R2  4.06,70.1 180 top
R3  12.19,89.41 270 top
R5  28.45,75.18 0 top
R6  3.05,89.41 270 top
R7  25.4,72.14 0 top
R9  23.37,57.91 0 top
R10  22.35,62.99 180 top
R11  22.35,66.04 0 top
R12  24.38,89.41 90 top
R13  21.34,89.41 90 top
R14  30.48,89.41 90 top
R15  21.34,84.33 90 top
R16  46.74,77.22 0 top
R18  27.43,84.33 90 top
R19  28.08,49.18 180 top
R20  46.74,80.26 0 top
R21  107.7,91.44 0 top
R22  130.05,41.66 0 top
R23  121.92,41.66 90 top
R24  125.98,41.66 90 top
R25  106.68,49.78 270 top
R26  110.74,51.82 90 top
R27  109.73,83.31 270 top
R28  112.78,83.31 270 top
R29  114.8,71.58 270 top
R30  123.95,90.42 270 top
R31  127,90.42 90 top
R32  106.68,83.31 270 top
R33  80.26,57.91 180 top
R34  75.18,64.01 0 top
R35  85.34,64.01 0 top
R36  70.1,57.91 180 top
R37  77.22,85.34 270 top
R38  80.26,85.34 90 top
R39  86.36,85.34 270 top
R40  88.39,88.39 0 top
R41  85.34,92.46 90 top
R42  75.18,72.14 0 top
R43  75.18,68.07 0 top
R44  49.78,43.69 90 top
R46  59.94,90.42 0 top
R47  50.8,55.88 180 top
R48  45.72,50.8 0 top
R49  49.78,58.93 90 top
R50  56.9,89.41 90 top
R52  52.83,69.09 270 top
R53  54.06,72.93 270 top
R54  53.14,82.51 0 top
R55  71.48,91.56 0 top
R56  46.74,60.96 270 top
R57  45.72,69.09 270 top
R58  42.67,69.09 270 top
U2  115,99 180 top
U3  127,99 180 top
U4  7,99 180 top
U5  31,99 180 top
U6(OHH)  91,99 180 top
U7  55,99 180 top
U8(CHH)  79,99 180 top
U9  43,99 180 top
U10  67,99 180 top
U11  19,99 180 top
U12  103,99 180 top
U13  126,10 270 bottom
U$2  114.98,13 90 top
VR1  13,78 0 top
VR2  37,78 0 top
VR3  121,56 0 top
VR4  108.71,66.04 270 bottom
VR5  61,78 0 top
VR6  121,34 0 top
VR7  121,78 0 top
VR8  61,34 0 top
VR9  13,56 0 top
VR10  13,34 0 top
VR11  15.24,17.27 0 bottom
VR12  91,12 0 top
VR13  91,34 0 top
VR14  61,12 0 top
VR15  10.16,7.11 180 bottom
VR16  61,56 0 top
VR17  37,56 0 top
VR18  91,56 0 top
VR19  91,78 0 top

### Tracks (layer width: path | path; a pad name or v marks a point on that pad's centre or on a via)
+5V  (via drill 0.51)
  Top 0.254: 26.42,67.06 26.42,72.3 R7.2 v26.25,73.78 | 26.42,67.06 23.2,63.84 R10.1 | 26.42,67.06 v27.43,67.06 | C50.+ 104.39,17 C18.+ 104.39,78.57 Q8.3 | INDUCTOR.+ 69.59,63.33 C26.1 | R36.1 70.95,61.29 C26.1 | C26.1 69.25,60.79 v70.1,59.94 | v72.14,36.58 v72.14,6.1 | v26.55,80.06 27.43,80.94 R18.1
  Top 0.356: C50.+ 115.6,6.85 C3.1 120,8.47 U$2.1 | R32.2 106.68,78.49 C18.+ | R49.2 48.77,59.78 R56.1 C37.1 41.66,61.81 38.44,65.02 v36.58,65.02
  Bottom 0.254: v70.1,59.94 70.1,57.91 74.17,53.85 74.17,38.61 v72.14,36.58 | v72.14,6.1 72.14,5.26 76.2,1.19 | v26.55,80.06 26.55,74.08 v26.25,73.78
  Bottom 0.356: v27.43,67.06 28.45,66.04 | C50.+ 101.82,6.32 96.7,1.19 76.2,1.19 40.46,1.19 28.45,13.21 28.45,66.04 | v36.58,65.02 29.46,65.02 28.45,66.04
GND  (via drill 0.51)
  Top 0.254: R1.1 7.84,92 11,92 11.37,91.63 | 11.37,91.63 12.19,90.81 12.19,90.42 | 12.19,90.42 R3.1 | 20.32,39.18 VR9.1 13.32,51.82 18.29,51.82 22.52,56.05 R9.1 10.5,69.93 VR1.1 10.5,83.65 14.22,87.38 14.22,89.41 13.21,90.42 12.19,90.42 | VR11.1 20.32,22.35 20.32,39.18 | 11.37,96.33 11.37,101.13 U4.P$3_SLEEVE U11.P$3_SLEEVE U5.P$3_SLEEVE U9.P$3_SLEEVE U7.P$3_SLEEVE U10.P$3_SLEEVE U8(CHH).P$3_SLEEVE U6(OHH).P$3_SLEEVE U12.P$3_SLEEVE | 11.37,96.33 11.37,91.63 | U12.P$3_SLEEVE 103.47,105.5 103.63,105.66 103.16,105.66 U12.P$3_SLEEVE | U12.P$3_SLEEVE 110.58,105.5 | 110.58,105.5 U2.P$3_SLEEVE U3.P$3_SLEEVE | R13.1 R12.1 | R15.2 R13.1 | R13.1 20.32,89.57 20.32,91.44 21.34,92.46 21.34,94.49 20.32,95.5 12.19,95.5 11.37,96.33 | VR2.1 34.5,72.09 37.59,75.18 46.74,75.18 47.59,76.03 R16.2 R20.2 C10.2 | R30.1 125.65,89.57 R31.1 128.02,88.56 v128.02,87.38 | VR7.1 122.94,75.44 122.94,79.25 125.98,82.3 v128.02,82.3 | C35.1 58.5,69.35 VR5.1 | R44.1 46.13,39.18 20.32,39.18 | R50.1 56.73,88.56 54.86,90.42 54.86,91.44 53.85,92.46 52.83,92.46 51.88,91.51 Q11.2 48.77,93.62 v48.77,95.5 | C20.- 107.44,62.23 VR4.3 108.71,52.67 106.76,50.72 | R21.2 108.71,91.61 108.71,103.63 110.58,105.5 | 85.34,91.44 R41.1 86.26,91.61 v87.44,90.42 | 85.34,91.44 85.34,90.59 80.95,86.19 R38.2 C27.2 | Q9.2 72.22,91.45 | 72.22,91.45 R55.2 | Q7.2 90.15,62.99 96.94,62.99 97.89,62.03 99.43,62.03 Q6.2 101.5,59.97 v101.5,57 | R25.1 106.76,50.72 | VR13.2 VR12.2 VR12.1 | 72.22,91.45 72.22,93.56 74.17,95.5 82.3,95.5 84.33,93.47 84.33,92.46 85.34,91.44 | C41.2 93.64,84.49 v94.49,85.34 | v106.68,53.85 106.68,50.8 106.76,50.72 | C2.2 108.87,19.15 v107.7,20.32
  Top 0.356: U13.8 U13.6 | U13.6 U13.4 125,12.54 | 125,12.54 U13.3 127.27,12.19 | 127.27,12.19 U13.5 | U13.5 U13.7 U13.8 | U13.5 U13.6 | U13.8 122.42,5.15 C3.2 116.44,5.15 C50.- | U$2.2 124.54,13 125,12.54 | C46.- 111.42,17.73 C2.2 | R30.1 122.94,92.29 122.94,103.63 123.95,104.65 126.15,104.65 U3.P$3_SLEEVE 131.23,105.5 132.81,103.92 132.81,13.93 131.06,12.19 127.27,12.19 | C18.- 106.93,73.66 C20.- | C15.- C16.-
  Bottom 0.254: VR2.1 34.5,84.37 23.37,95.5 23.37,101.13 U11.P$3_SLEEVE | v128.02,82.3 129.03,83.31 129.03,86.36 v128.02,87.38 | U7.P$3_SLEEVE 48.77,99.27 v48.77,95.5 49.78,95.5 51.82,93.47 51.82,77.68 VR5.1 VR16.1 62.33,52.83 C24.- | VR15.1 VR15.2 VR11.2 VR11.1 | VR18.3 v101.5,57 105.46,60.96 VR4.3 | C46.- 100.27,17.73 VR13.2 VR13.1 | 108.2,25.91 109.73,24.38 127,24.38 128.83,26.21 128.83,61.77 131.06,64.01 131.06,72.14 130.05,73.15 120.65,73.15 VR7.1 118.5,70.73 C15.- | 108.2,25.91 106.68,27.43 v106.68,53.85 | v94.49,85.34 96.52,87.38 96.52,102.62 93.64,105.5 U6(OHH).P$3_SLEEVE 87.21,105.5 85.34,103.63 85.34,95.5 87.44,93.41 v87.44,90.42 | C20.- 104.65,73.15 101.14,69.64 89.26,69.64 88.5,70.4 VR19.1 | v107.7,20.32 107.7,25.4 108.2,25.91
N$1
  Bottom 0.254: U10.P$2_SWITCH 62.99,98.49 62.99,71.51 VR5.3
N$2  (via drill 0.51)
  Top 0.254: C4.1 5.22,64.01 4.91,64.31 C1.1 6.1,67.06 v7.11,66.04 | v20.32,51.82 17.5,49 VR9.3 VR9.2
  Bottom 0.254: v7.11,66.04 13.21,59.94 18.29,59.94 20.32,57.91 v20.32,51.82
N$3  (via drill 0.51)
  Top 0.254: C1.2 3.21,68.55 | 3.21,68.55 R2.2 | v22.35,73.15 23.37,72.14 R7.1 23.53,73.15 C7.1 | v12.19,65.02 11.18,65.02 7.11,60.96 7.11,58.93 6.1,57.91 4.15,57.91 Q1.3 v4.06,61.98 | v4.5,68.56 3.23,68.56 3.21,68.55
  Bottom 0.254: v22.35,73.15 20.32,73.15 v12.19,65.02 | v4.06,61.98 5.08,62.99 5.08,67.98 v4.5,68.56
N$5
  Top 0.254: Q1.1 5.01,61.04 9.06,65.09 9.06,65.96 R2.1 6.1,71.29 6.1,86.36 8.13,88.39 9.14,88.39 C6.2
N$6
  Top 0.254: C6.1 7.44,88.56 R1.2 R6.2 4.91,86.69 C5.2
N$7  (via drill 0.51)
  Top 0.254: C5.1 3.13,73.07 | 3.13,73.07 2.02,71.96 2.02,65.2 C4.2 | v10.16,86.36 10.16,86.53 R3.2 | v3.05,79.25 3.05,73.15 3.13,73.07
  Bottom 0.254: v10.16,86.36 v3.05,79.25
N$8
  Top 0.254: R20.1 43.69,82.46 43.69,86.36 43.6,86.44 Q3.2
N$9
  Top 0.254: R14.2 29.13,90.26 C9.2 26.08,88.56 R12.2
N$10
  Top 0.254: VR10.2 VR10.1 2.03,35.47 2.03,58.95 Q1.2
N$11
  Top 0.254: R14.1 31.58,88.56 D3.A 34.46,91.44 45.72,91.44 47.92,89.24 47.92,85.34 C10.1
N$12
  Top 0.254: Q2.1 30.4,71.12 27.6,73.92 R5.1 C7.2
N$13
  Top 0.254: R11.1 R10.2 22.52,61.98 24.38,61.98 28.45,66.04 Q2.3 32.6,71.04 29.3,74.33 R5.2
N$14
  Top 0.254: R9.2 30.4,64.09 Q2.2
N$15
  Top 0.254: C8.1 R11.2
N$16
  Top 0.254: R15.1 23.04,85.18 C13.1 25.57,86.36 31.5,86.36 33.44,88.31 D3.C 34.63,88.31 C11.1
N$17  (via drill 0.51)
  Top 0.254: C12.1 38.28,90.26 C11.2 v36.58,86.36 | R16.1 44.7,78.4 44.7,79.25 42.67,81.28 42.67,83.31 v41.66,84.33
  Bottom 0.254: v41.66,84.33 41.66,86.36 40.64,87.38 37.59,87.38 v36.58,86.36
N$18
  Top 0.254: 29.46,92.46 22.35,92.46 21.34,91.44 R13.2 | C9.1 27.43,90.43 29.46,92.46 | 29.46,92.46 U5.P$1_TIP
N$19
  Top 0.254: R24.1 127.17,40.81 128.02,41.66 128.02,43.69 126.07,45.64 D4.A 119.89,45.64 117.94,43.69 Q4.3
N$20
  Top 0.254: C16.+ 128.02,53.85 125.98,51.82 D4.C 125.98,48.77 123.79,50.97 R26.1 108.71,48.93 R25.2
N$21  (via drill 0.51)
  Top 0.254: Q3.1 43.54,89.41 40.64,89.41 39.79,88.56 C12.2 39.62,87.38 v38.61,86.36
  Bottom 0.254: VR17.1 38.61,53.11 38.61,64.56 43.69,69.64 43.69,79.25 38.61,84.33 v38.61,86.36
N$22
  Top 0.254: C14.2 28.94,60.44 31.5,62.99 33.53,62.99 34.54,64.01 34.54,67.06 36.58,69.09 38.61,69.09 39.5,69.98 VR2.3
N$23
  Top 0.254: R19.2 27.23,52.97 C14.1
N$24
  Top 0.254: VR3.1 118.5,45.37 Q4.1
N$25
  Top 0.254: R22.1 130.3,42.76 130.3,48.01 | C40.+ 130.3,48.77 130.3,48.01 | VR3.2 123.26,46.74 129.03,46.74 130.3,48.01
N$26
  Top 0.254: C21.- 113.79,78.18 113.79,75.18 114.8,74.18 R29.1
N$27  (via drill 0.51)
  Top 0.254: C17.- 125.98,74.82 125.98,73.48 VR7.3 118.54,66.04 115.82,66.04 v111.76,70.1 | C39.2 42.84,64.01 50.8,64.01 51.82,65.02 v60.96,65.02 | C30.2 v84.33,72.14
  Bottom 0.254: v60.96,65.02 69.09,65.02 73.15,69.09 86.36,69.09 | v111.76,70.1 110.74,69.09 86.36,69.09 | 86.36,69.09 84.33,71.12 v84.33,72.14
N$28  (via drill 0.51)
  Top 0.254: VR4.2 110.24,65.02 121.67,65.02 C15.+ | R23.2 R24.2 124.97,43.52 v124.97,44.7
  Bottom 0.254: C15.+ 121.92,59.94 122.94,58.93 122.94,53.85 124.97,51.82 v124.97,44.7
N$29
  Top 0.254: Q4.2 121.85,40.71 121.92,40.64 R23.1 122.77,40.81 123.95,39.62 129.03,39.62 130.9,41.49 R22.2 132.08,42.84 132.08,73.99 C17.+
N$30
  Top 0.254: R29.2 114.8,69.1 116.84,67.06 117.86,67.06 121,70.2 VR7.2
N$31  (via drill 0.51)
  Top 0.254: Q5.1 118.89,85.34 115.82,85.34 112.94,82.46 R28.2 112.78,80.84 C21.+ 110.68,76.26 v111.76,75.18
  Bottom 0.254: v111.76,75.18 112.78,74.17 112.78,31.5 117.27,27 VR6.1
N$32  (via drill 0.51)
  Top 0.254: C22.1 119.44,92.01 v116.84,89.41
  Bottom 0.254: v116.84,89.41 118.87,87.38 118.87,75.18 113.79,70.1 113.79,32.18 114.47,31.5 116.84,31.5 121,27.34 VR6.2
N$33
  Top 0.254: U3.P$1_TIP R31.2 130.47,91.27 C19.-
N$34
  Top 0.254: Q6.1 95.64,57.91 R33.1
N$35
  Top 0.254: R32.1 108.03,84.16 R27.2 107.7,80.43 107.7,78.23 109.98,75.95 C20.+ 108.71,71.88 VR4.1
N$36
  Top 0.254: R30.2 121.69,87.31 Q5.2
N$37
  Top 0.254: R33.2 76.03,61.29 R34.2 C23.1 82.46,67.06 95.66,67.06 Q6.3
N$38  (via drill 0.51)
  Top 0.254: C36.2 48.92,71.98 v48.77,72.14 | C25.1 75.18,83.48 v75.18,82.3 | v68.07,66.04 68.07,50.8 53.85,36.58 53.85,26.42 55.88,24.38 58.93,24.38 61,26.46 VR8.2
  Bottom 0.254: v48.77,72.14 48.77,54.86 58.93,44.7 58.93,29.07 VR8.2 | v75.18,82.3 71.12,78.23 71.12,69.09 v68.07,66.04
N$39
  Top 0.254: C23.2 82.78,65.68 87.38,65.68 | 87.38,65.68 Q7.1 | R35.2 87.38,65.19 87.38,65.68
N$40  (via drill 0.51)
  Top 0.254: Q7.3 88.44,64.73 88.2,64.48 88.2,63.81 87.38,62.99 85.51,62.99 R35.1 82.46,61.98 v80.26,61.98
  Bottom 0.254: v80.26,61.98 80.26,60.96 77.22,57.91 77.22,39.62 64.59,27 VR8.3
N$41
  Top 0.254: VR8.1 62.99,31.5 62.99,43.43 72.26,52.7 | R36.2 69.25,57.75 72.26,54.74 72.26,52.7 | R34.1 72.39,62.06 C24.+ 72.26,52.7
N$42
  Top 0.254: R37.1 C25.2
N$43
  Top 0.254: C42.2 97.54,80.26 98.55,79.25 98.55,70.1 102.62,66.04 102.62,48.77 100.58,46.74 92.46,46.74 91,48.19 VR18.2 VR18.1
N$44
  Top 0.254: C27.1 84.49,84.49 86.36,86.36 R39.1 87.54,87.38 R40.1
N$45
  Top 0.254: C41.1 91.36,86.28 91.36,88.39 | 91.36,88.39 Q8.2 | R40.2 91.36,88.39
N$46
  Top 0.254: Q9.3 70.02,75.14 INDUCTOR.- 71.76,74.71 R42.1 R43.1 74.17,67.91 74.17,66.04 73.15,65.02 72.99,65.02 C26.2
N$47
  Top 0.254: C28.2 95.74,90.36 Q8.1 90.27,91.44 87.21,91.44 R41.2
N$48
  Top 0.254: R43.2 C29.1
N$49
  Top 0.254: R42.2 C30.1
N$50
  Top 0.254: D5.C 110.74,61.89 R26.2
N$51
  Top 0.254: C31.1 52.83,44.54 R44.2 47.07,44.54 C32.1
N$52  (via drill 0.51)
  Top 0.254: Q3.3 42.67,88.39 39.46,85.18 R18.2 25.73,83.48 C13.2 v24.38,79.25 | VR17.3 VR17.2 34.74,46.74 30.48,46.74 28.93,48.29 | 28.93,48.29 28.93,48.77 R19.1 | v25.4,45.72 27.43,45.72 28.93,47.21 28.93,48.29
  Bottom 0.254: v24.38,79.25 24.38,46.74 v25.4,45.72
N$53
  Top 0.254: C32.2 46.57,46.74 R48.2 46.74,50.8 47.75,51.82 47.75,53.68 R47.2 49.78,56.05 R49.1 50.97,58.08 51.82,58.93 51.82,61.98 52.83,62.99 53.76,62.99 Q10.3
N$54
  Top 0.254: R48.1 C34.1
N$55
  Top 0.254: R47.1 52.9,57.13 Q10.1 54,61.98 59.78,61.98 C33.2
N$56
  Top 0.254: C33.1 64.09,67.99 | 64.09,67.99 66.04,69.94 66.04,72.14 60.79,77.38 R46.2 | C31.2 58.57,46.57 VR16.2 VR16.3 63.5,61.47 66.04,64.01 66.04,66.04 64.09,67.99
N$57
  Top 0.254: C8.2 19.59,71 VR1.3
N$58
  Top 0.254: R52.2 53.08,67.99 D6.C
N$59
  Top 0.254: R53.2 54.06,71.17 52.91,70.02 | 52.91,70.02 R52.1 | C35.2 57.06,69.09 53.85,69.09 52.91,70.02
N$60  (via drill 0.51)
  Top 0.254: R54.2 53.99,90.3 Q11.1 | R54.2 53.99,73.85 R53.1 | R54.2 v56.83,85.34 | v61.98,85.34 v66.04,85.34 | R55.1 71.12,91.07 v71.12,85.34
  Bottom 0.254: v66.04,85.34 v71.12,85.34 | v56.83,85.34 v61.98,85.34
N$61
  Top 0.254: R54.1 52.29,74.64 51.33,73.68 C36.1
N$62
  Top 0.254: Q11.3 50.8,86.28 50.8,76.2 45.72,71.12 45.72,70.1 | 45.72,70.1 42.84,70.1 R58.1 40.47,69.94 38.61,68.07 36.58,68.07 35.56,67.06 35.56,64.01 39.46,60.11 C37.2 R56.2 | R57.1 45.72,70.1
N$63
  Top 0.254: U4.P$1_TIP 6.79,94 R6.1
N$64
  Top 0.254: C39.1 R58.2
N$65
  Top 0.254: R57.2 47.07,68.24 C38.1
N$66  (via drill 0.51)
  Top 0.254: D5.A 111.68,66.12 109.73,68.07 109.73,70.1 112.78,73.15 112.78,76.2 111.82,77.16 111.82,79.21 114.81,82.2 v114.81,82.3
  Bottom 0.254: v114.81,82.3 114.81,93.81 U2.P$1_TIP
N$67
  Top 0.254: C28.1 93.79,94 U6(OHH).P$1_TIP
N$68
  Top 0.254: R50.2 55,92.15 U7.P$1_TIP | R46.1 R50.2 | D6.A 55.88,73.15 58.93,76.2 58.93,88.23 R50.2
N$69
  Top 0.254: VR11.3 10.16,21.66 VR10.3
N$70  (via drill 0.51)
  Top 0.254: Q12.2 75.25,88.46 v75.18,88.39 | v72.14,70.1 v72.14,66.04 | v75.18,41.66 75.18,14.22 86.36,3.05 92.46,3.05 93.5,4.09 VR12.3
  Bottom 0.254: v75.18,88.39 76.2,87.38 76.2,74.17 v72.14,70.1 | v72.14,66.04 72.14,57.91 75.18,54.86 v75.18,41.66
N$71  (via drill 0.51)
  Top 0.254: VR14.2 VR14.1 52.83,10.67 v52.83,38.61 | v49.78,48.77 53.85,52.83 53.85,59.93 Q10.2
  Bottom 0.254: v52.83,38.61 49.78,41.66 v49.78,48.77
N$72  (via drill 0.51)
  Top 0.254: v101.6,73.15 103.63,71.12 103.63,31.5 99.14,27 VR13.3 | Q12.3 82.3,91.36 v82.3,91.44
  Bottom 0.254: v82.3,91.44 92.46,81.28 98.55,81.28 101.6,78.23 v101.6,73.15
N$73
  Top 0.254: Q12.1 79,91.21 U8(CHH).P$1_TIP
N$74
  Top 0.254: VR14.3 63.5,4.57 61.98,3.05 19.3,3.05 VR15.3
N$75  (via drill 0.51)
  Top 0.254: v46.74,66.04 46.74,66.21 C38.2 50.97,66.04 59.94,66.04 v61.98,68.07 | v47.75,57.91 46.57,56.73 C34.2 | v68.07,68.07 68.07,92.93 U10.P$1_TIP
  Bottom 0.254: v46.74,66.04 46.74,58.93 v47.75,57.91 | v61.98,68.07 v68.07,68.07
N$76
  Top 0.254: VR2.2 40.17,74.17 47.75,74.17 49.78,76.2 49.78,88.39 44.18,94 U9.P$1_TIP
N$77
  Top 0.356: U$2.3 116.97,19.05 D1.C 114.27,20 C46.+ 110.58,20.27 C2.1
N$78  (via drill 0.51)
  Top 0.254: R27.1 R28.1 114.97,86.36 Q5.3 116.76,87.29 119.77,90.31 C22.2 120.41,88.88 v120.9,88.39 | C19.+ 128.27,85.34 123.95,85.34 v122.94,86.36
  Bottom 0.254: v122.94,86.36 v120.9,88.39
N$79
  Top 0.254: R39.2 85.34,83.48 81.28,83.48 R38.1 R37.2 77.38,84.33 C42.1 77.32,80.33 Q9.1
N$80
  Top 0.254: VR1.2 11.18,72.82 11.18,83.31 19,91.14 U11.P$1_TIP
N$81
  Top 0.356: U13.2 124.73,16.65 D1.A
N$82
  Top 0.254: U11.P$2_SWITCH 22.47,102.5 25.4,99.57 25.4,97.54 27.43,95.5 34.54,95.5 36.58,97.54 36.58,99.57 39.51,102.5 42.67,102.5 | U9.P$2_SWITCH 50.68,102.5 51.94,103.76 58.8,103.76 59.94,102.62 | VR5.2 59.94,72.06 59.94,102.62 | 59.94,102.62 61.13,103.81 101.69,103.81 102.88,102.62 | 102.88,102.62 U12.P$2_SWITCH | R21.1 106.68,91.61 106.68,101.6 105.66,102.62 102.88,102.62
  Top 0.356: U9.P$2_SWITCH 42.67,102.5
  Bottom 0.254: C40.- 132.86,55.9 132.86,105.66 131.75,106.77 107.27,106.77 U12.P$2_SWITCH
N$83
  Top 0.254: VR19.3 90.57,68.07 C29.2
N$84  (via drill 0.51)
  Top 0.254: VR19.2 94.17,74.17 v96.52,74.17 | v100.58,76.2 100.58,80.26 v96.52,84.33
  Bottom 0.254: v96.52,74.17 98.55,76.2 v100.58,76.2 | v96.52,84.33 96.52,86.36 97.54,87.38 101.6,87.38 103,88.78 U12.P$1_TIP

### Text on the board
tPlace: SD TRIG / OUT | HH TRIGx2 / OUT | MASTER TRIG / OUT | BD TRIG / OUT | RS TRIG / OUT